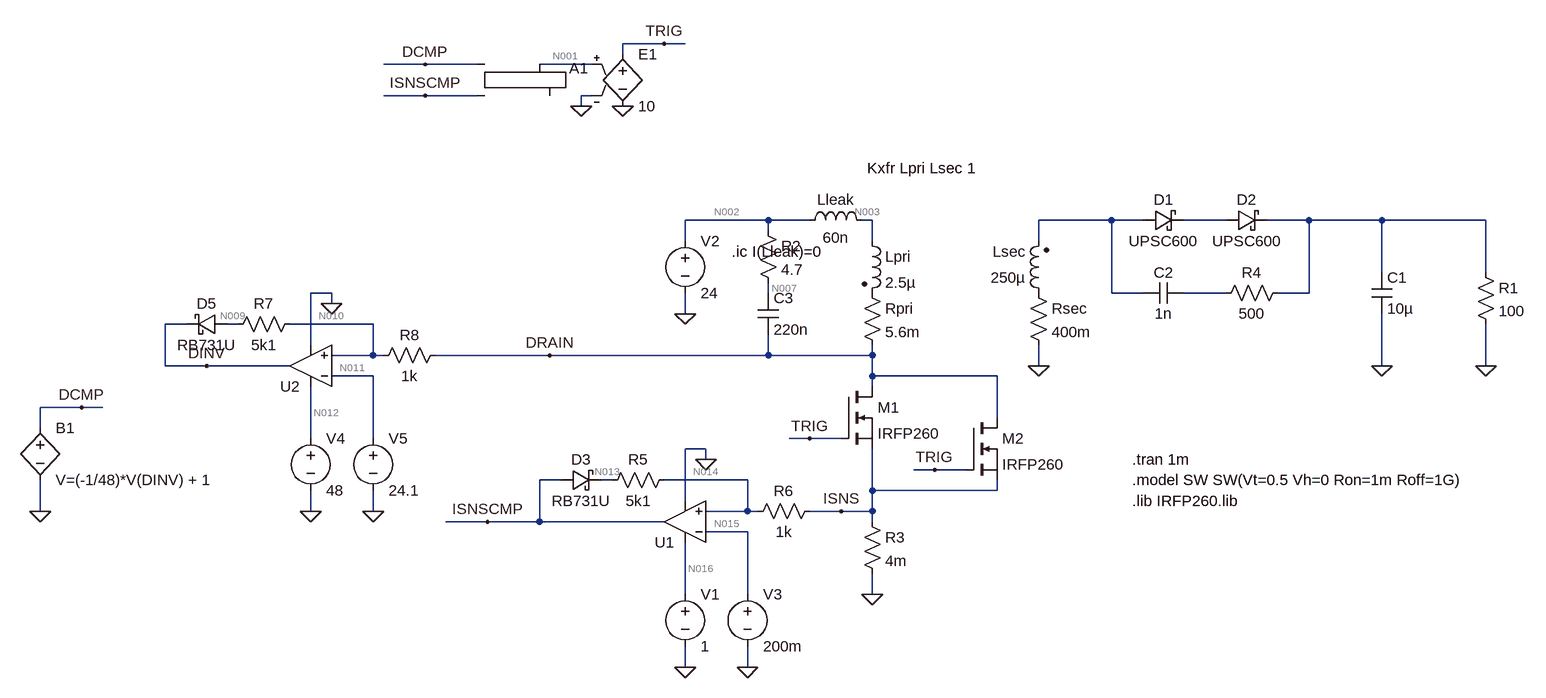
[diagram p0: schematic HVPS2.asc]
HVPS2.asc, the LTspice schematic file:
Version 4
SHEET 1 1156 788
WIRE -176 -192 -240 -192
WIRE -144 -192 -176 -192
WIRE -240 -176 -240 -192
WIRE -544 -160 -608 -160
WIRE -464 -160 -544 -160
WIRE -288 -160 -368 -160
WIRE -544 -112 -608 -112
WIRE -464 -112 -544 -112
WIRE -288 -112 -304 -112
WIRE -304 -96 -304 -112
WIRE -16 80 -144 80
WIRE 48 80 -16 80
WIRE 144 80 128 80
WIRE 512 80 400 80
WIRE 560 80 512 80
WIRE 688 80 624 80
WIRE 816 80 752 80
WIRE 928 80 816 80
WIRE 1088 80 928 80
WIRE -16 96 -16 80
WIRE -144 112 -144 80
WIRE 144 112 144 80
WIRE 400 112 400 80
WIRE 928 160 928 80
WIRE 1088 160 1088 80
WIRE -688 192 -720 192
WIRE -16 192 -16 176
WIRE 512 192 512 80
WIRE 560 192 512 192
WIRE 688 192 624 192
WIRE 816 192 816 80
WIRE 816 192 768 192
WIRE -688 208 -688 192
WIRE -144 224 -144 192
WIRE -912 240 -944 240
WIRE -832 240 -848 240
WIRE -624 240 -752 240
WIRE -720 272 -720 192
WIRE -624 288 -624 240
WIRE -624 288 -688 288
WIRE -608 288 -624 288
WIRE -352 288 -528 288
WIRE -16 288 -16 256
WIRE -16 288 -352 288
WIRE 144 288 144 272
WIRE 144 288 -16 288
WIRE -944 304 -944 240
WIRE -880 304 -944 304
WIRE -752 304 -880 304
WIRE 400 304 400 272
WIRE 928 304 928 224
WIRE 1088 304 1088 240
WIRE -624 320 -688 320
WIRE 144 320 144 288
WIRE 336 320 144 320
WIRE 144 336 144 320
WIRE -1072 368 -1136 368
WIRE -1040 368 -1072 368
WIRE 336 384 336 320
WIRE -1136 400 -1136 368
WIRE -720 416 -720 336
WIRE -624 416 -624 320
WIRE 48 416 16 416
WIRE 96 416 48 416
WIRE -112 432 -144 432
WIRE -112 448 -112 432
WIRE 240 464 208 464
WIRE 288 464 240 464
WIRE -336 480 -368 480
WIRE -256 480 -272 480
WIRE -48 480 -176 480
WIRE 144 496 144 432
WIRE 336 496 336 480
WIRE 336 496 144 496
WIRE -144 512 -144 432
WIRE -1136 528 -1136 480
WIRE -720 528 -720 496
WIRE -624 528 -624 496
WIRE -48 528 -48 480
WIRE -48 528 -112 528
WIRE -32 528 -48 528
WIRE 96 528 48 528
WIRE 144 528 144 496
WIRE 144 528 96 528
WIRE -448 544 -512 544
WIRE -368 544 -368 480
WIRE -368 544 -448 544
WIRE -176 544 -368 544
WIRE 144 544 144 528
WIRE -48 560 -112 560
WIRE -144 656 -144 576
WIRE -48 656 -48 560
WIRE 144 656 144 624
WIRE -144 768 -144 736
WIRE -48 768 -48 736
FLAG 928 304 0
FLAG 1088 304 0
FLAG -144 224 0
FLAG -352 288 DRAIN
FLAG 48 416 TRIG
FLAG -176 -192 TRIG
FLAG -544 -160 DCMP
FLAG 144 656 0
FLAG 96 528 ISNS
FLAG -544 -112 ISNSCMP
FLAG 400 304 0
FLAG -112 448 0
FLAG -144 768 0
FLAG -48 768 0
FLAG -448 544 ISNSCMP
FLAG 240 464 TRIG
FLAG -304 -96 0
FLAG -240 -96 0
FLAG -688 208 0
FLAG -720 528 0
FLAG -624 528 0
FLAG -1072 368 DCMP
FLAG -880 304 DINV
FLAG -1136 528 0
SYMBOL ind2 128 96 R0
SYMATTR InstName Lpri
SYMATTR Value 2.5µ
SYMATTR Type ind
SYMBOL ind2 416 208 R180
WINDOW 0 36 80 Left 2
WINDOW 3 36 40 Left 2
SYMATTR InstName Lsec
SYMATTR Value 250µ
SYMATTR Type ind
SYMBOL ind 144 96 M270
WINDOW 0 32 56 VTop 2
WINDOW 3 5 56 VBottom 2
SYMATTR InstName Lleak
SYMATTR Value 60n
SYMBOL res 128 176 R0
SYMATTR InstName Rpri
SYMATTR Value 5.6m
SYMBOL res 384 176 R0
SYMATTR InstName Rsec
SYMATTR Value 400m
SYMBOL schottky 560 96 R270
WINDOW 0 32 32 VTop 2
WINDOW 3 0 32 VBottom 2
SYMATTR InstName D1
SYMATTR Value UPSC600
SYMATTR Description Diode
SYMATTR Type diode
SYMBOL schottky 688 96 R270
WINDOW 0 32 32 VTop 2
WINDOW 3 0 32 VBottom 2
SYMATTR InstName D2
SYMATTR Value UPSC600
SYMATTR Description Diode
SYMATTR Type diode
SYMBOL cap 912 160 R0
SYMATTR InstName C1
SYMATTR Value 10µ
SYMBOL res 1072 144 R0
SYMATTR InstName R1
SYMATTR Value 100
SYMBOL voltage -144 96 R0
WINDOW 123 0 0 Left 0
WINDOW 39 0 0 Left 0
SYMATTR InstName V2
SYMATTR Value 24
SYMBOL Digital\\srflop -416 -208 R0
SYMATTR InstName A1
SYMATTR SpiceLine ic=1
SYMBOL res 128 528 R0
SYMATTR InstName R3
SYMATTR Value 4m
SYMBOL voltage -144 640 R0
WINDOW 123 0 0 Left 0
WINDOW 39 0 0 Left 0
SYMATTR InstName V1
SYMATTR Value 1
SYMBOL voltage -48 640 R0
WINDOW 123 0 0 Left 0
WINDOW 39 0 0 Left 0
SYMATTR InstName V3
SYMATTR Value 200m
SYMBOL res -160 464 R90
WINDOW 0 0 56 VBottom 2
WINDOW 3 32 56 VTop 2
SYMATTR InstName R5
SYMATTR Value 5k1
SYMBOL schottky -336 496 R270
WINDOW 0 32 32 VTop 2
WINDOW 3 0 32 VBottom 2
SYMATTR InstName D3
SYMATTR Value RB731U
SYMATTR Description Diode
SYMATTR Type diode
SYMBOL res 64 512 R90
WINDOW 0 0 56 VBottom 2
WINDOW 3 32 56 VTop 2
SYMATTR InstName R6
SYMATTR Value 1k
SYMBOL OpAmps\\UniversalOpAmp2 -144 544 R180
SYMATTR InstName U1
SYMATTR Value2 Avol=10000Meg GBW=100000Meg Slew=100000Meg
SYMBOL cap 624 176 R90
WINDOW 0 0 32 VBottom 2
WINDOW 3 32 32 VTop 2
SYMATTR InstName C2
SYMATTR Value 1n
SYMBOL res 784 176 R90
WINDOW 0 0 56 VBottom 2
WINDOW 3 32 56 VTop 2
SYMATTR InstName R4
SYMATTR Value 500
SYMBOL nmos 96 336 R0
SYMATTR InstName M1
SYMATTR Value IRFP260
SYMATTR Prefix X
SYMBOL nmos 288 384 R0
SYMATTR InstName M2
SYMATTR Value IRFP260
SYMATTR Prefix X
SYMBOL e -240 -192 R0
SYMATTR InstName E1
SYMATTR Value 10
SYMBOL voltage -720 400 R0
WINDOW 123 0 0 Left 0
WINDOW 39 0 0 Left 0
SYMATTR InstName V4
SYMATTR Value 48
SYMBOL voltage -624 400 R0
WINDOW 123 0 0 Left 0
WINDOW 39 0 0 Left 0
SYMATTR InstName V5
SYMATTR Value 24.1
SYMBOL res -736 224 R90
WINDOW 0 0 56 VBottom 2
WINDOW 3 32 56 VTop 2
SYMATTR InstName R7
SYMATTR Value 5k1
SYMBOL schottky -848 256 M270
WINDOW 0 32 32 VTop 2
WINDOW 3 0 32 VBottom 2
SYMATTR InstName D5
SYMATTR Value RB731U
SYMATTR Description Diode
SYMATTR Type diode
SYMBOL res -512 272 R90
WINDOW 0 0 56 VBottom 2
WINDOW 3 32 56 VTop 2
SYMATTR InstName R8
SYMATTR Value 1k
SYMBOL OpAmps\\UniversalOpAmp2 -720 304 R180
SYMATTR InstName U2
SYMATTR Value2 Avol=10000Meg GBW=100000Meg Slew=100000Meg
SYMBOL bv -1136 384 R0
SYMATTR InstName B1
SYMATTR Value V=(-1/48)*V(DINV) + 1
SYMBOL cap -32 192 R0
SYMATTR InstName C3
SYMATTR Value 220n
SYMBOL res -32 80 R0
SYMATTR InstName R2
SYMATTR Value 4.7
TEXT 136 0 Left 2 !Kxfr Lpri Lsec 1
TEXT 544 480 Left 2 !.model SW SW(Vt=0.5 Vh=0 Ron=1m Roff=1G)
TEXT 544 448 Left 2 !.tran 1m
TEXT -72 128 Left 2 !.ic I(Lleak)=0
TEXT 544 512 Left 2 !.lib IRFP260.lib

The netlist it stands for:
* HVPS2.asc
Lpri N003 P001 2.5µ
Lsec P002 N004 250µ
Lleak N003 N002 60n
Rpri P001 DRAIN 5.6m
Rsec P002 0 400m
D1 N004 N005 UPSC600
D2 N005 N006 UPSC600
C1 N006 0 10µ
R1 N006 0 100
V2 N002 0 24
A1 DCMP ISNSCMP 0 0 0 0 N001 0 SRFLOP ic=1
R3 ISNS 0 4m
V1 N016 0 1
V3 N015 0 200m
R5 N014 N013 5k1
D3 ISNSCMP N013 RB731U
R6 ISNS N014 1k
XU1 N014 N015 N016 0 ISNSCMP level2 Avol=10000Meg GBW=100000Meg Slew=100000Meg Ilimit=25m Rail=0 Vos=0 En=0 Enk=0 In=0 Ink=0 Rin=500Meg  ; pins In+ In- V+ V- OUT
C2 N008 N004 1n
R4 N006 N008 500
XM1 DRAIN TRIG ISNS IRFP260  ; pins D G S
XM2 DRAIN TRIG ISNS IRFP260  ; pins D G S
E1 TRIG 0 N001 0 10
V4 N012 0 48
V5 N011 0 24.1
R7 N010 N009 5k1
D5 N009 DINV RB731U
R8 DRAIN N010 1k
XU2 N010 N011 N012 0 DINV level2 Avol=10000Meg GBW=100000Meg Slew=100000Meg Ilimit=25m Rail=0 Vos=0 En=0 Enk=0 In=0 Ink=0 Rin=500Meg  ; pins In+ In- V+ V- OUT
B1 DCMP 0 V=(-1/48)*V(DINV) + 1
C3 N007 DRAIN 220n
R2 N002 N007 4.7
.model D D
.lib standard.dio
Kxfr Lpri Lsec 1
.model SW SW(Vt=0.5 Vh=0 Ron=1m Roff=1G)
.tran 1m
.ic I(Lleak)=0
.lib IRFP260.lib
.lib UniversalOpAmp2.lib
.backanno
.end

* Results of the author's LTspice run, read from the files saved beside the schematic
* Operating Point, zero values left out:
*   V(n003) = 11.18 µV
*   V(p001) = 11.18 µV
*   V(n002) = 24 V
*   V(drain) = 8.942 µV
*   V(dcmp) = 999.7 mV
*   V(isnscmp) = 519.7 µV
*   V(n001) = 1 V
*   V(isns) = 1.6 µV
*   V(n016) = 1 V
*   V(n015) = 200 mV
*   V(n014) = 4.308 µV
*   V(n013) = 13.02 µV
*   V(trig) = 10 V
*   V(n012) = 48 V
*   V(n011) = 24.1 V
*   V(n010) = 90.2 µV
*   V(n009) = 259.8 µV
*   V(dinv) = 12.12 mV
*   V(n007) = 24 V
*   I(D3) = 1.708 nA
*   I(D5) = -33.25 nA
*   I(Lpri) = 400 µA
*   I(Lleak) = -400 µA
*   I(Rpri) = 400 µA
*   I(R3) = 400.1 µA
*   I(R5) = -1.708 nA
*   I(R6) = -2.708 nA
*   I(R7) = -33.25 nA
*   I(R8) = -81.25 nA
*   I(V2) = -400 µA
*   I(V1) = -2.287 µA
*   I(V3) = 600 pA
*   I(V4) = -76.59 µA
*   I(V5) = -200 pA
*   Ix(u1:1) = -1 nA
*   Ix(u1:2) = -600 pA
*   Ix(u1:3) = 2.287 µA
*   Ix(u1:4) = -2.278 µA
*   Ix(u1:5) = -1.708 nA
*   Ix(m1:1) = 200 µA
*   Ix(m1:3) = -200 µA
*   Ix(m2:1) = 200 µA
*   Ix(m2:3) = -200 µA
*   Ix(u2:1) = -48 nA
*   Ix(u2:2) = 200 pA
*   Ix(u2:3) = 76.59 µA
*   Ix(u2:4) = -76.26 µA
*   Ix(u2:5) = -33.25 nA